# Altium schematic sheet 01-FBD.SchDoc
size A4; Organization: ORGANIZATION; Address1: ADDRESS 1; Address2: ADDRESS 2; Address3: ADDRESS 3; Address4: ADDRESS 4; SheetNumber: 2; SheetTotal: 5; ENG_APP_DATE: --/--/--; DSN_APP_DATE: --/--/--; CHK_APP_DATE: --/--/--
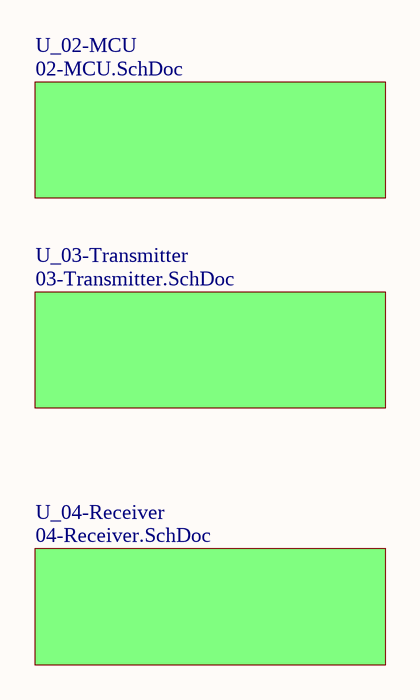
[diagram p0: 01-FBD.SchDoc]

## Sub-sheets
U_02-MCU = 02-MCU.SchDoc: no entries
U_03-Transmitter = 03-Transmitter.SchDoc: no entries
U_04-Receiver = 04-Receiver.SchDoc: no entries

## Notes on the sheet
- Revision
- Project
- Author
- Page Title